# Altium schematic sheet VeggieIrrigation.SchDoc
size A4
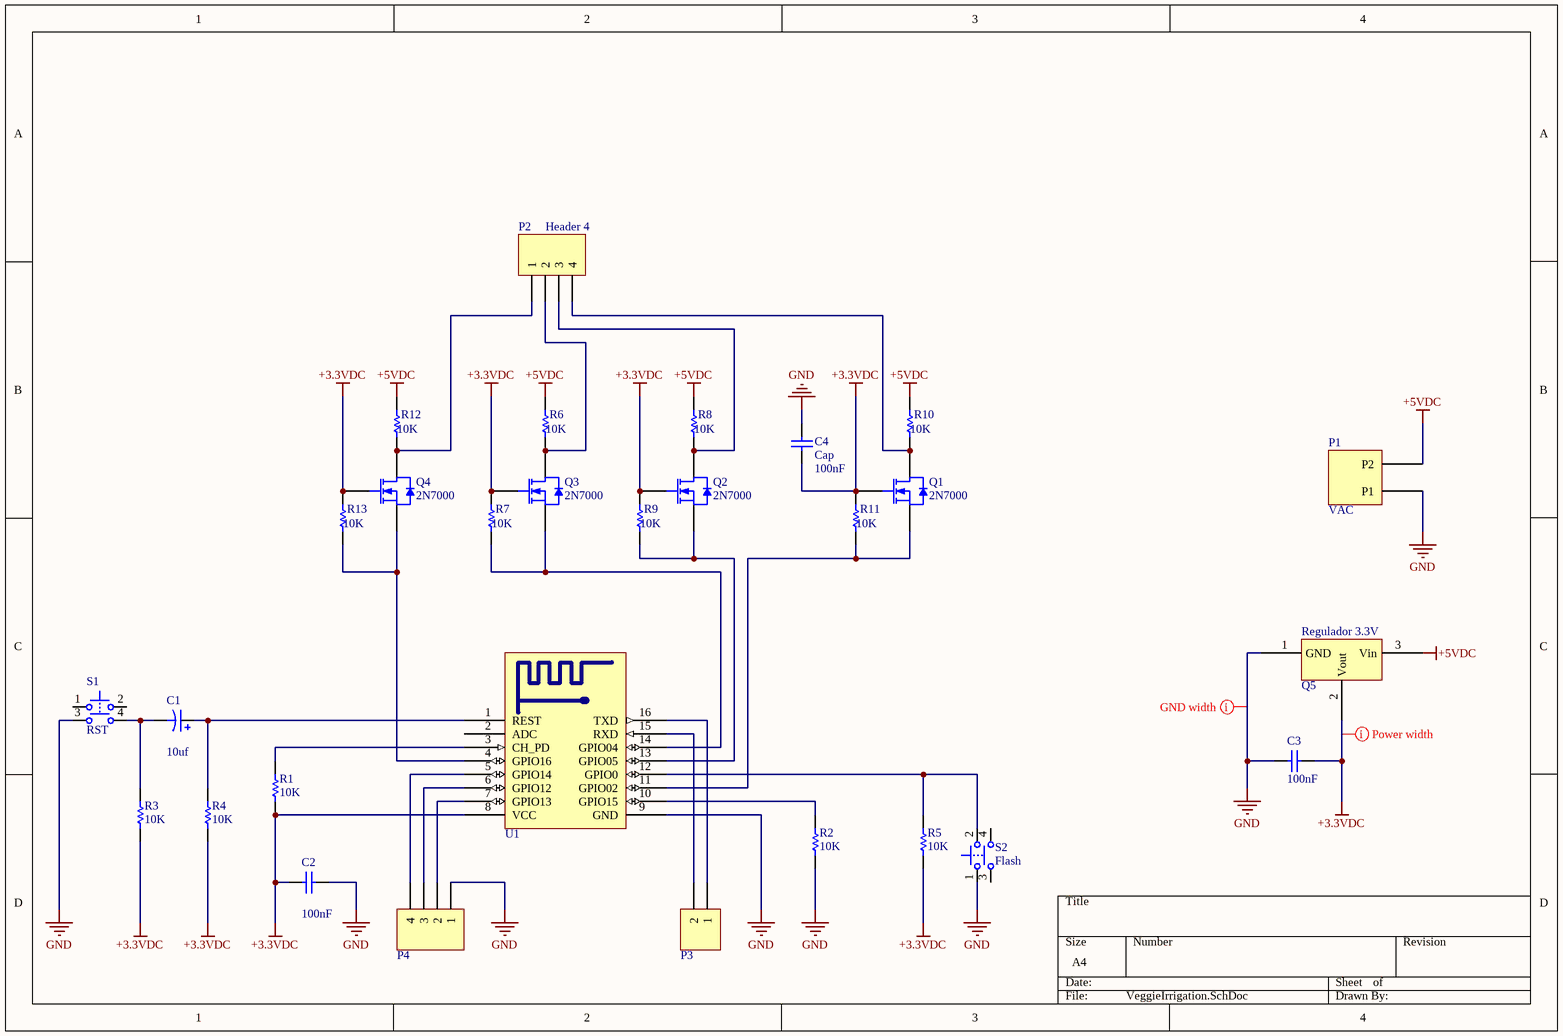
[diagram p0: VeggieIrrigation.SchDoc]

## Parts
C1  10uf  [RAD-0.1]
C2  100nf  [RAD-0.1]
C3  100nf  [RAD-0.1]
C4  Cap  value 100nF  [RAD-0.3]
P1  VAC  [ScrewTerminal-X2]
P2  Header 4  [HDR1X4]
P3  (no value)  [HDR1X2]
P4  (no value)  [HDR1X4]
Q1  2N7000  [SOT54]
Q2  2N7000  [SOT54]
Q3  2N7000  [SOT54]
Q4  2N7000  [SOT54]
Q5  Regulador 3.3V  [TO-220-AB]
R1  10K  [AXIAL-0.3]
R2  10K  [AXIAL-0.3]
R3  10K  [AXIAL-0.3]
R4  10K  [AXIAL-0.3]
R5  10K  [AXIAL-0.3]
R6  10K  [AXIAL-0.3]
R7  10K  [AXIAL-0.3]
R8  10K  [AXIAL-0.3]
R9  10K  [AXIAL-0.3]
R10  10K  [AXIAL-0.3]
R11  10K  [AXIAL-0.3]
R12  10K  [AXIAL-0.3]
R13  10K  [AXIAL-0.3]
S1  RST  [IT-2175]
S2  Flash  [IT-2175]
U1  ESP-12  [ESP_12]  (value not drawn)

## Nets
+3.3VDC: C2.1 C3.2 C4.1 Q1.2(G) Q2.2(G) Q3.2(G) Q4.2(G) Q5.2(Vout) R1.1 R3.2 R4.2 R5.2 R7.2 R9.2 R11.2 R13.2 U1.8(VCC)
+5VDC: P1.2(P2) Q5.3(Vin) R6.2 R8.2 R10.2 R12.2
GND: C2.2 C3.1 C4.2 P1.1(P1) P4.1 Q5.1(GND) R2.2 S1.3 S2.1 U1.9(GND)
NetC1_1: C1.1 R4.1 U1.1(REST)
NetC1_2: C1.2 R3.1 S1.4
NetP2_1: P2.1 Q4.1(D) R12.1
NetP2_2: P2.2 Q3.1(D) R6.1
NetP2_3: P2.3 Q2.1(D) R8.1
NetP2_4: P2.4 Q1.1(D) R10.1
NetP3_1: P3.1 U1.16(TXD)
NetP3_2: P3.2 U1.15(RXD)
NetP4_2: P4.2 U1.7(GPIO13)
NetP4_3: P4.3 U1.6(GPIO12)
NetP4_4: P4.4 U1.5(GPIO14)
NetQ1_3: Q1.3(S) R11.1 U1.11(GPIO02)
NetQ2_3: Q2.3(S) R9.1 U1.13(GPIO05)
NetQ3_3: Q3.3(S) R7.1 U1.14(GPIO04)
NetQ4_3: Q4.3(S) R13.1 U1.4(GPIO16)
NetR1_2: R1.2 U1.3(CH_PD)
NetR2_1: R2.1 U1.10(GPIO15)
NetR5_1: R5.1 S2.2 U1.12(GPIO0)

Not connected (* = marked no-connect by the designer): S1 1 2; S2 3 4; U1 2(ADC)

## Layout directives
rule Width Constraint [Pref Width = 25mil    Min Width = 20mil    Max Width = 30mil]: GND
rule Width Constraint [Pref Width = 25mil    Min Width = 15mil    Max Width = 30mil]: +3.3VDC

## Library data of the parts
C1 = Cap Pol1: Polarized Capacitor (Radial); Published: 8-Jun-2000; LatestRevisionDate: 17-Jul-2002; LatestRevisionNote: Re-released for DXP Platform.; PackageReference: RB7.6-15; Publisher: Altium Limited; PackageDescription: Polarized Capacitor (Radial); 2 Leads; Value: 10uf
C2-C4 = Cap: Capacitor; Published: 8-Jun-2000; LatestRevisionDate: 17-Jul-2002; LatestRevisionNote: Re-released for DXP Platform.; PackageReference: RAD-0.3; Publisher: Altium Limited; PackageDescription: Radial Cap, Thru-Hole; 2 Leads; 0.3 in Pin Spacing
  C2 C3: Value: 100nF
P1 = ScrewTerminal
P2 P4 = Header 4: Header, 4-Pin; LatestRevisionDate: 17-Jul-2002; LatestRevisionNote: Re-released for DXP Platform.; Publisher: Altium Limited
P3 = Header 2: Header, 2-Pin; LatestRevisionDate: 17-Jul-2002; LatestRevisionNote: Re-released for DXP Platform.; Publisher: Altium Limited
Q1-Q4 = 2N7000: N-channel Enhancement Mode Field-effect Transistor; Published: 17-Sep-2003; LatestRevisionDate: 12-Dec-2006; LatestRevisionNote: Footprint pad sequence fixed.; DatasheetVersion: 19-May-2000; PackageVersion: Feb-1997; PackageReference: SOT54; Publisher: Altium Limited; PackageDescription: Plastic Single-Ended Leaded (through hole) package; 3 Leads (TO-92); Code_JEITA: SC-43; Code_JEDEC: TO-92; ComponentLink1Description: Manufacturer Link; ComponentLink1URL: http://www.semiconductors.philips.com/; ComponentLink2Description: Datasheet; ComponentLink2URL: http://www.semiconductors.philips.com/acrobat/datasheets/2N7000-03.pdf
Q5 = AMS1117
R1-R13 = Res1: Resistor; Published: 8-Jun-2000; LatestRevisionDate: 17-Jul-2002; LatestRevisionNote: Re-released for DXP Platform.; PackageReference: AXIAL-0.3; Publisher: Altium Limited; PackageDescription: Axial Device, Thru-Hole; 2 Leads; 0.3 in Pin Spacing; Value: 10K
S1 S2 = IT-2175: Tactile Switch, DPST; Thru-Hole; Vertical; Rating DC 12V, 50mA (max); PackageDocument: Rev.0; Published: 6-Jun-2005; DatasheetDocument: Rev.0; PackageReference: IT-2175; Publisher: Altium Limited; ComponentLink1Description: Manufacturer Link; ComponentLink1URL: http://www.ilswitch.com/; ComponentLink2Description: Device Overview; ComponentLink2URL: http://www.ilswitch.com/list.php?ac_id=010112&ai_id=91